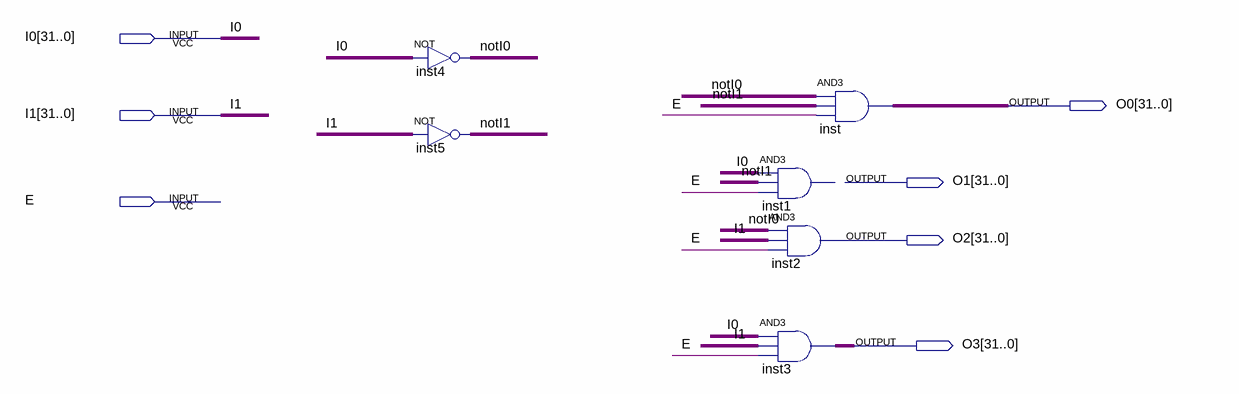
[diagram p0: schematic sheet]
// Quartus schematic DC2_32.bdf as structural Verilog: 6 symbols, 7 pins
module DC2_32 (
  input  [31:0] I0,
  input  [31:0] I1,
  input  E,
  output [31:0] O0,
  output [31:0] O1,
  output [31:0] O2,
  output [31:0] O3
);

  wire I0_1bit, I1_1bit, notI0, notI1;

  not inst4 (notI0, I0_1bit);
  not inst5 (notI1, I1_1bit);
  // AND3 inst1 has open pins: IN1=I0_1bit, IN2=notI1, IN3=E, OUT=open
  assign O2 = {32{notI0}} & {32{I1_1bit}} & {32{E}};  // AND3 inst2, 32 bits wide
  assign O3 = {32{I0_1bit}} & {32{I1_1bit}} & {32{E}};  // AND3 inst3, 32 bits wide
  assign O0 = {32{notI0}} & {32{notI1}} & {32{E}};  // AND3 inst, 32 bits wide
endmodule
